# EAGLE schematic BoardTsu (EAGLE 6.3)
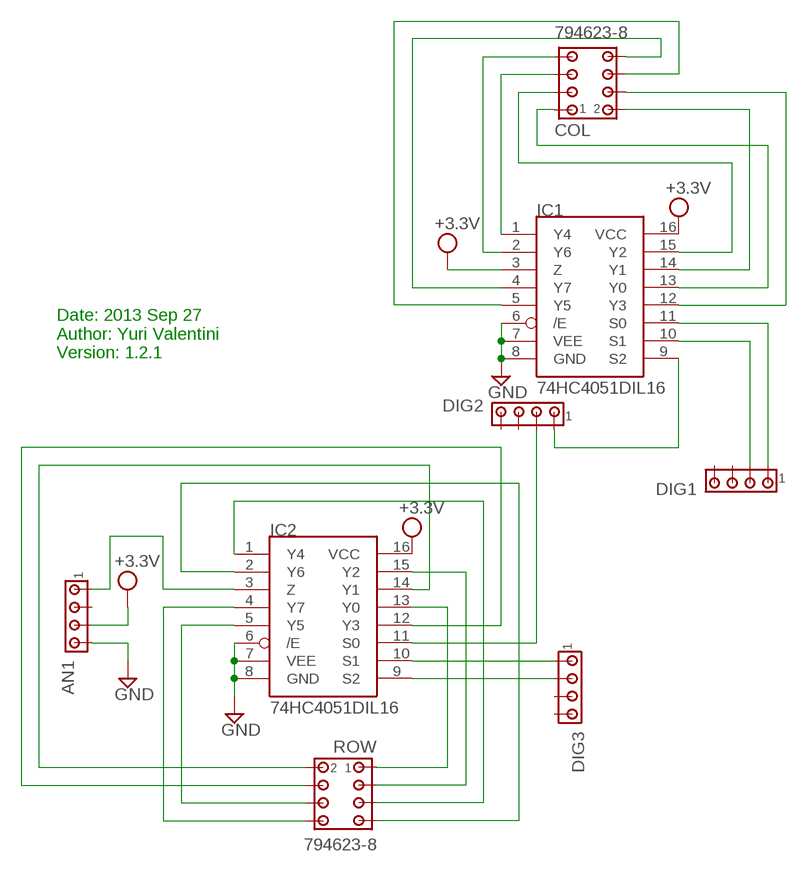
[diagram p0: schematic, sheet 1]

## Parts
AN1  MTA04-156  [1X4MTA]
COL  794623-8  [794623-8]
DIG1  MTA04-156  [1X4MTA]
DIG2  MTA04-156  [1X4MTA]
DIG3  MTA04-156  [1X4MTA]
IC1  74HC4051DIL16  [DIL16]
IC2  74HC4051DIL16  [DIL16]
ROW  794623-8  [794623-8]

## Nets
GND: AN1.4 IC1.6(/E) IC1.7(VEE) IC1.8(GND) IC2.6(/E) IC2.7(VEE) IC2.8(GND)
N$1: COL.4 IC1.12(Y3)
N$2: COL.1 IC1.13(Y0)
N$3: COL.2 IC1.14(Y1)
N$4: COL.3 IC1.15(Y2)
N$5: COL.5 IC1.1(Y4)
N$6: COL.6 IC1.5(Y5)
N$7: COL.8 IC1.4(Y7)
N$8: COL.7 IC1.2(Y6)
N$9: DIG1.1 IC1.11(S0)
N$10: DIG1.2 IC1.10(S1)
N$11: DIG2.1 IC1.9(S2)
N$12: DIG2.2 IC2.11(S0)
N$13: DIG3.1 IC2.10(S1)
N$14: DIG3.2 IC2.9(S2)
N$15: AN1.1 IC2.3(Z)
N$16: IC2.13(Y0) ROW.1
N$17: IC2.14(Y1) ROW.2
N$18: IC2.15(Y2) ROW.3
N$19: IC2.12(Y3) ROW.4
N$20: IC2.1(Y4) ROW.5
N$21: IC2.5(Y5) ROW.6
N$23: IC2.2(Y6) ROW.7
N$24: IC2.4(Y7) ROW.8
VCC: AN1.3 IC1.3(Z) IC1.16(VCC) IC2.16(VCC) ; supply symbol labelled +3.3V
Unconnected: AN1.2 DIG1.3 DIG1.4 DIG2.3 DIG2.4 DIG3.3 DIG3.4

## Notes on the sheet
- Date: 2013 Sep 27
  Author: Yuri Valentini
  Version: 1.2.1

## Library data of the parts
AN1 DIG1-DIG3 = con-amp:MTA04-156: AMP connector
COL ROW = con-amp:794623-8: MICRO MATE N LOK Dual Row, grid 1.5 mm Source: http://catalog.tycoelectronics.com .. ENG_CD_794623_F.pdf
IC1 IC2 = LibTsu:74HC4051